# EAGLE design xor (EAGLE 7.4.0)
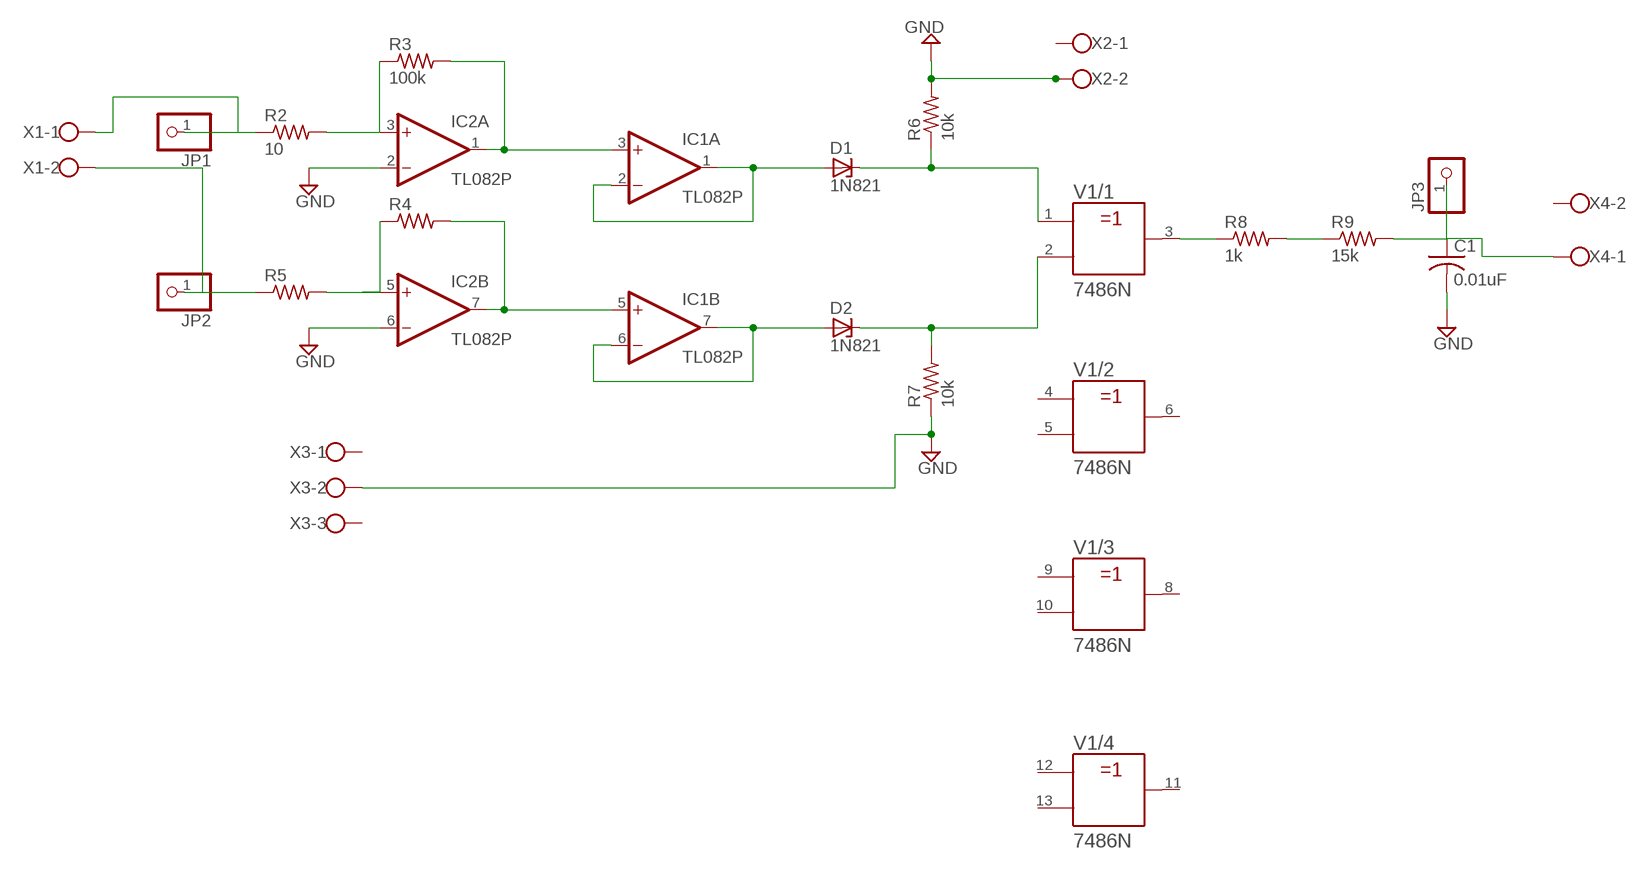
[diagram p0: schematic, sheet 1]

## Parts
C1  0.01uF  C-US050-045X075  [C050-045X075]
D1  1N821  [DO35Z10]
D2  1N821  [DO35Z10]
IC1  TL082P  [DIL08]
IC2  TL082P  [DIL08]
JP1  PINHD-1X1CB  [1X01-CLEANBIG]
JP2  PINHD-1X1CB  [1X01-CLEANBIG]
JP3  PINHD-1X1CB  [1X01-CLEANBIG]
R2  10  R-US_0309/10  [0309/10]
R3  100k  R-US_0309/10  [0309/10]
R4  R-US_0309/10  [0309/10]
R5  R-US_0309/10  [0309/10]
R6  10k  R-US_0309/10  [0309/10]
R7  10k  R-US_0309/10  [0309/10]
R8  1k  R-US_0309/10  [0309/10]
R9  15k  R-US_0309/10  [0309/10]
V1  7486N  [DIL14]
X1  W237-102  [W237-102]
X2  W237-102  [W237-102]
X3  W237-103  [W237-103]
X4  W237-102  [W237-102]

## Nets
GND: C1.2 IC2.2(A:-IN) IC2.6(B:-IN) R6.2 R7.1 X2.2 X3.2
N$1: IC2.3(A:+IN) R2.2 R3.1
N$2: IC1.3(A:+IN) IC2.1(A:OUT) R3.2
N$3: IC2.5(B:+IN) R4.1 R5.2
N$4: IC1.5(B:+IN) IC2.7(B:OUT) R4.2
N$5: D1.A IC1.1(A:OUT) IC1.2(A:-IN)
N$6: D2.A IC1.6(B:-IN) IC1.7(B:OUT)
N$7: D1.C R6.1 V1.1(/1:A)
N$8: D2.C R7.2 V1.2(/1:B)
N$9: R8.1 V1.3(/1:Y)
N$10: R8.2 R9.1
N$11: C1.1 JP3.1 R9.2 X4.1
N$12: JP1.1 R2.1 X1.1
N$13: JP2.1 R5.1 X1.2
Unconnected: V1.4(/2:A) V1.5(/2:B) V1.6(/2:Y) V1.8(/3:Y) V1.9(/3:A) V1.10(/3:B) V1.11(/4:Y) V1.12(/4:A) V1.13(/4:B) X2.1 X3.1 X3.3 X4.2

## Power pins joined to a net without a drawn wire
+UB: V1.14(/+UB:+UB)
-UB: V1.7(/-UB:-UB)
V+: IC1.8(P:V+) IC2.8(P:V+)
V-: IC1.4(P:V-) IC2.4(P:V-)

## Library data of the parts
C1 = adafruit:C-US: CAPACITOR, American symbol
D1 D2 = diode:1N821: Reference DIODE temperature compensated, 6,2 V
IC1 IC2 = linear:TL082: OP AMP Data sheet <http://www.ti.com/lit/ds/symlink/tl084a . pdf>; DATA_SHEET: <a href="http://www.ti.com/lit/ds/symlink/tl084a.pdf"> Data sheet </a>
JP1-JP3 = adafruit:PINHD-1X1: Pin header 1x1 for 0.1" spacing With round pins
R2-R9 = adafruit:R-US_: RESISTOR, American symbol
V1 = 74ttl-din:74*86: Quad 2-input EXCLUSIV-OR gate
X1 X2 X4 = con-wago-500:W237-102: WAGO SCREW CLAMP; MPN: 237-102; OC_FARNELL: unknown; OC_NEWARK: 70K9898
X3 = con-wago-500:W237-103: WAGO SCREW CLAMP; MPN: 237-103; OC_FARNELL: unknown; OC_NEWARK: 18M7116

## Board
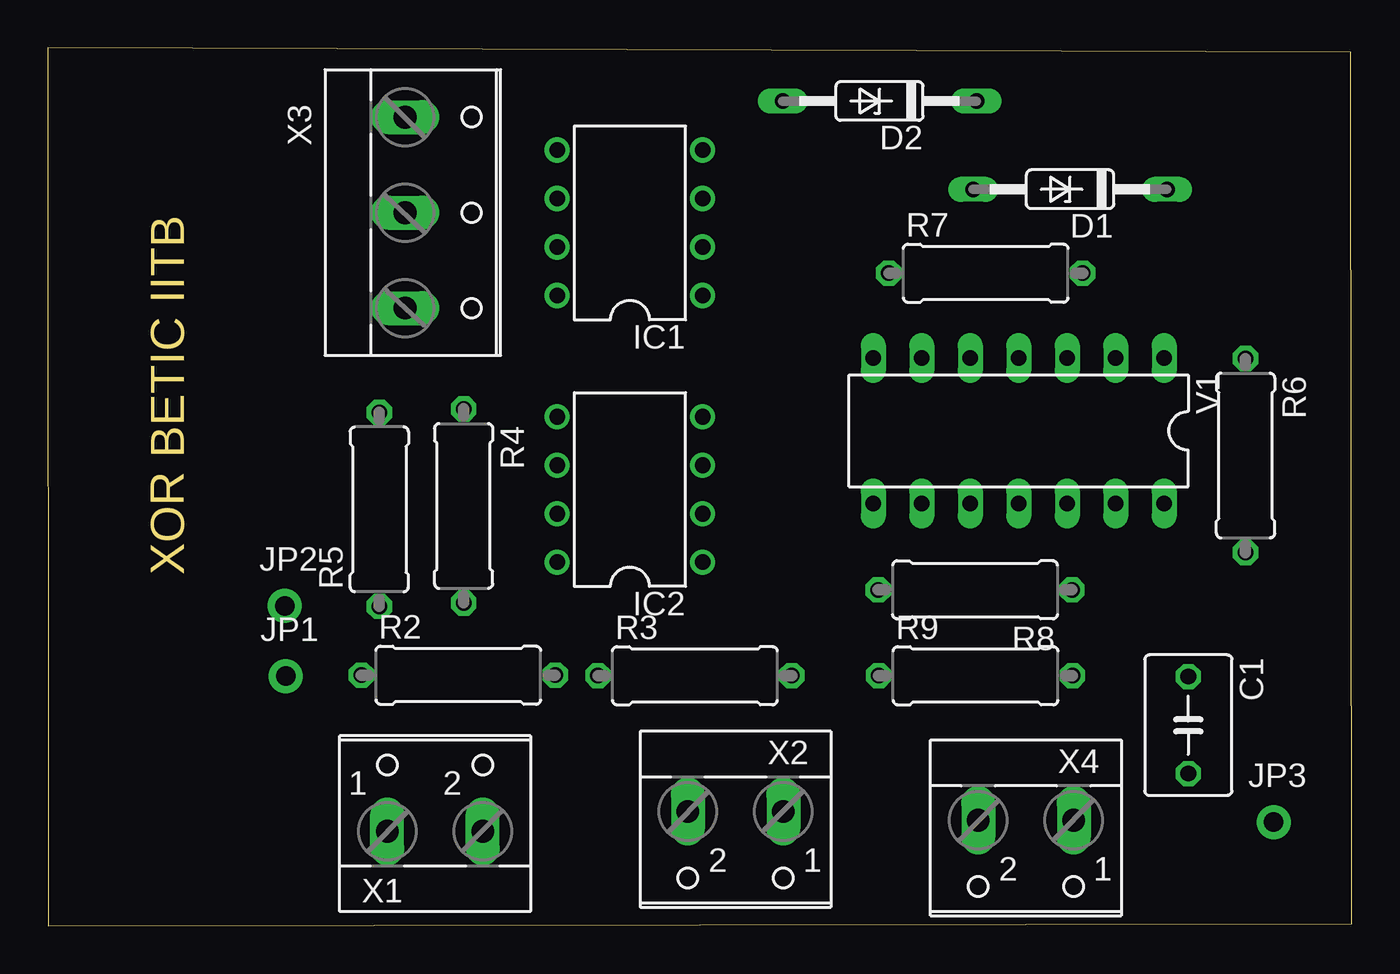
[diagram p1: board, top side]
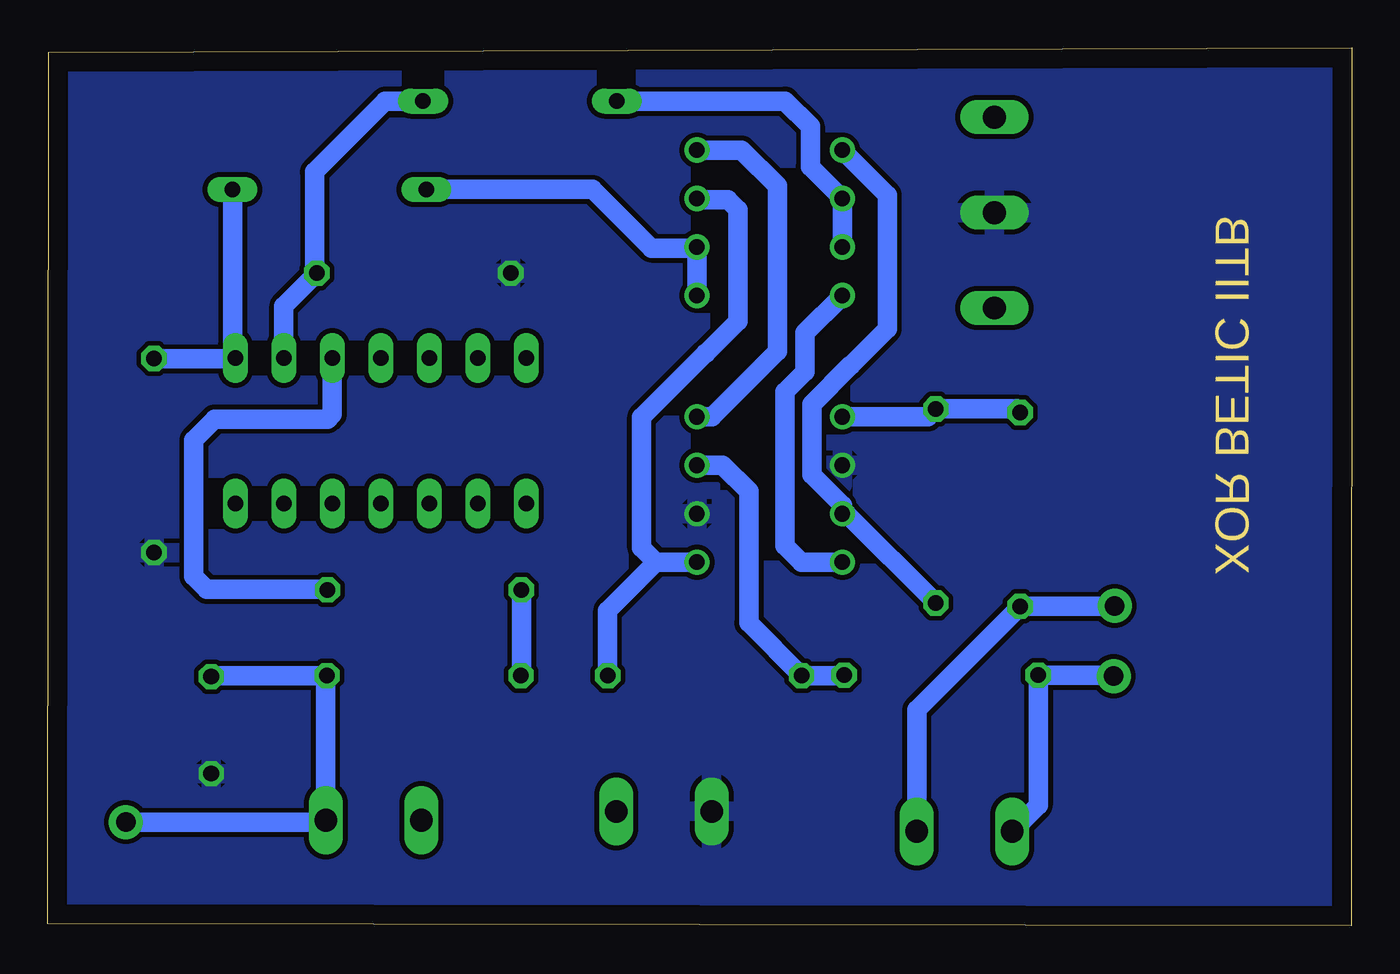
[diagram p2: board, bottom side, seen from below]

Size 68.33 x 46 mm. Coordinates in mm from the lower left corner, seen from the top.
Outline: 0.03,0 68.33,0.1 68.28,45.77 0,46 0.03,0
Copper layers (1*16): Top 0.035mm / dielectric 1.5mm / Bottom 0.035mm
Design rules "default *": minimum track width 10mil, minimum drill 24mil, track to track 10mil, track to pad 10mil, pad to pad 8mil, via to via 8mil, smd to smd 8mil, copper to edge 40mil, drill to drill 8mil, minimum pad ring 10mil, minimum via ring 8mil, stop-mask expansion 4mil, vias tented up to drill 0mil, thermal gap 10mil

### Footprints (pad centres in the part's own frame; a part is rotated, then mirrored left to right if it is on the bottom)
C050-045X075 = drill 0.813 octagon: 1 -2.54,0; 2 2.54,0
DO35Z10 = drill 0.813 long: A 5.08,0; C -5.08,0
DIL08 = drill 0.813 pad 1.27: 1 -3.81,-3.81; 2 -1.27,-3.81; 3 1.27,-3.81; 4 3.81,-3.81; 5 3.81,3.81; 6 1.27,3.81; 7 -1.27,3.81; 8 -3.81,3.81
1X01-CLEANBIG = drill 1.016 pad 1.778: 1 0,0
0309/10 = drill 0.813 octagon: 1 -5.08,0; 2 5.08,0
DIL14 = drill 0.813 long: 1 -7.62,-3.81; 2 -5.08,-3.81; 3 -2.54,-3.81; 4 0,-3.81; 5 2.54,-3.81; 6 5.08,-3.81; 7 7.62,-3.81; 8 7.62,3.81; 9 5.08,3.81; 10 2.54,3.81; 11 0,3.81; 12 -2.54,3.81; 13 -5.08,3.81; 14 -7.62,3.81
W237-102 = drill 1.194 long: 1 -2.5,-1.27; 2 2.5,-1.27
W237-103 = drill 1.194 long: 1 -5,-1.29; 2 0,-1.29; 3 5,-1.29

### Placement (x,y rotation side)
C1  59.77,10.52 270 top
D1  53.57,38.58 180 top
D2  43.59,43.21 180 top
IC1  30.51,36.83 90 top
IC2  30.51,22.86 90 top
JP1  12.47,13.08 0 top
JP2  12.42,16.76 0 top
JP3  64.24,5.44 0 top
R2  21.51,13.13 0 top
R3  33.91,13.11 0 top
R4  21.79,22 270 top
R5  17.37,21.82 90 top
R6  62.76,24.64 270 top
R7  49.15,34.19 0 top
R8  48.59,17.6 180 top
R9  48.62,13.11 0 top
V1  50.88,25.93 180 top
X1  20.29,6.22 0 top
X2  36.04,4.72 180 top
X3  20.02,37.36 270 top
X4  51.26,4.27 180 top

### Tracks (layer width: path | path; a pad name or v marks a point on that pad's centre or on a via)
GND
  pour Bottom: 0.03,46.2 0.03,0 68.55,0.18 68.17,45.47
N$1
  Bottom 1.016: R2.2 26.62,13.11 R3.1 31.6,15.88 31.6,22.76 32.97,24.13 IC2.3
N$2
  Bottom 1.016: IC2.1 36.45,19.05 | 36.45,19.05 37.21,19.81 37.21,26.64 33.86,30 33.83,30 32.16,31.67 32.16,37.52 32.69,38.05 34.26,38.05 IC1.3 | R3.2 38.99,16.51 36.45,19.05
N$3
  Bottom 1.016: IC2.5 22.2,26.67 R4.1 17.55,27.08 R5.2
N$4
  Bottom 1.016: R4.2 26.47,21.59 IC2.7 26.7,22.02 28.3,23.62 28.3,27.33 26.26,29.36 26.24,29.36 24.33,31.27 24.33,38.28 IC1.5
N$5
  Bottom 1.016: D1.A 39.78,38.58 36.7,35.51 34.37,35.51 IC1.2 IC1.1
N$6
  Bottom 1.016: IC1.7 IC1.6 28.37,39.78 28.37,41.88 29.69,43.2 D2.A
N$7
  Bottom 1.016: D1.C 58.65,29.9 V1.1 58.52,29.72 R6.1
N$8
  Bottom 1.016: D2.C 50.65,43.2 54.36,39.5 54.36,34.31 R7.2 55.96,32.46 V1.2
N$9
  Bottom 1.016: V1.3 53.42,26.8 53.67,26.54 59.59,26.54 60.68,25.45 60.68,18.31 59.99,17.63 53.7,17.63 R8.1
N$10
  Bottom 1.016: R8.2 43.51,13.13 R9.1
N$11
  Bottom 1.016: C1.1 59.72,13.11 R9.2 53.76,13.04 X4.1 53.86,5.44 JP3.1
N$12
  Bottom 1.016: X1.1 16.43,6.31 R2.1 12.52,13.13 JP1.1
N$13
  Bottom 1.016: JP2.1 12.45,16.74 R5.1 22.79,11.32 X1.2
V+
  Bottom 1.016: IC2.8 28.83,19.05 29.69,19.91 29.69,27.99 28.65,29.03 28.65,31.06 IC1.8
V-
  Bottom 1.016: IC2.4 33.53,26.67 30.1,30.1 30.1,38.76 31.98,40.64 IC1.4

### Text on the board
Dimension: XOR BETIC IITB